# Altium project DEV_KIT.PrjPcb
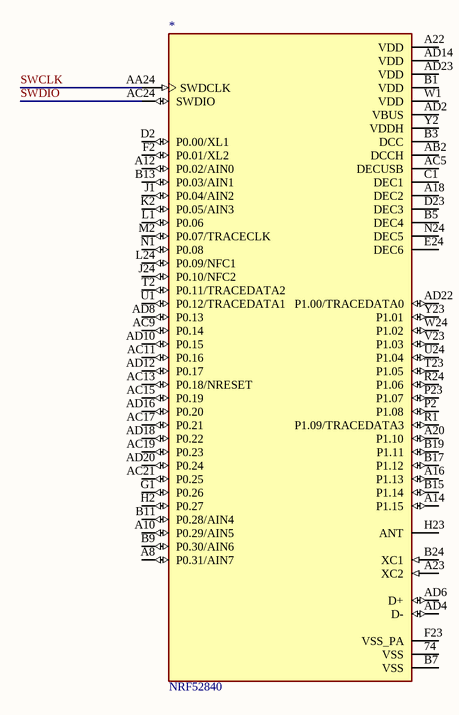
[diagram p0: main.SchDoc]
1 sheet, 1 parts. Net scope: global (net labels, ports and power ports of the same name join across sheets).

## Sheet main.SchDoc
size A; Author: Kyuubi; SheetNumber: 1; SheetTotal: 1

### Parts
*  NRF52840

### Nets
SWCLK: *.AA24(SWDCLK)
SWDIO: *.AC24(SWDIO)

Not connected (* = marked no-connect by the designer): * 74(VSS) A8(P0.31/AIN7) A10(P0.29/AIN5) A12(P0.02/AIN0) A14(P1.15) A16(P1.13) A18(DEC2) A20(P1.10) A22(VDD) A23(XC2) AB2(DCCH) AC5(DECUSB) AC9(P0.14) AC11(P0.16) AC13(P0.18/NRESET) AC15(P0.19) AC17(P0.21) AC19(P0.23) AC21(P0.25) AD2(VBUS) AD4(D-) AD6(D+) AD8(P0.13) AD10(P0.15) AD12(P0.17) AD14(VDD) AD16(P0.20) AD18(P0.22) AD20(P0.24) AD22(P1.00/TRACEDATA0) AD23(VDD) B1(VDD) B3(DCC) B5(DEC4) B7(VSS) B9(P0.30/AIN6) B11(P0.28/AIN4) B13(P0.03/AIN1) B15(P1.14) B17(P1.12) B19(P1.11) B24(XC1) C1(DEC1) D2(P0.00/XL1) D23(DEC3) E24(DEC6) F2(P0.01/XL2) F23(VSS_PA) G1(P0.26) H2(P0.27) H23(ANT) J1(P0.04/AIN2) J24(P0.10/NFC2) K2(P0.05/AIN3) L1(P0.06) L24(P0.09/NFC1) M2(P0.07/TRACECLK) N1(P0.08) N24(DEC5) P2(P1.08) P23(P1.07) R1(P1.09/TRACEDATA3) R24(P1.06) T2(P0.11/TRACEDATA2) T23(P1.05) U1(P0.12/TRACEDATA1) U24(P1.04) V23(P1.03) W1(VDD) W24(P1.02) Y2(VDDH) Y23(P1.01)